# Altium schematic sheet TAFLab Sensors.SchDoc
size 297 x 209 mm
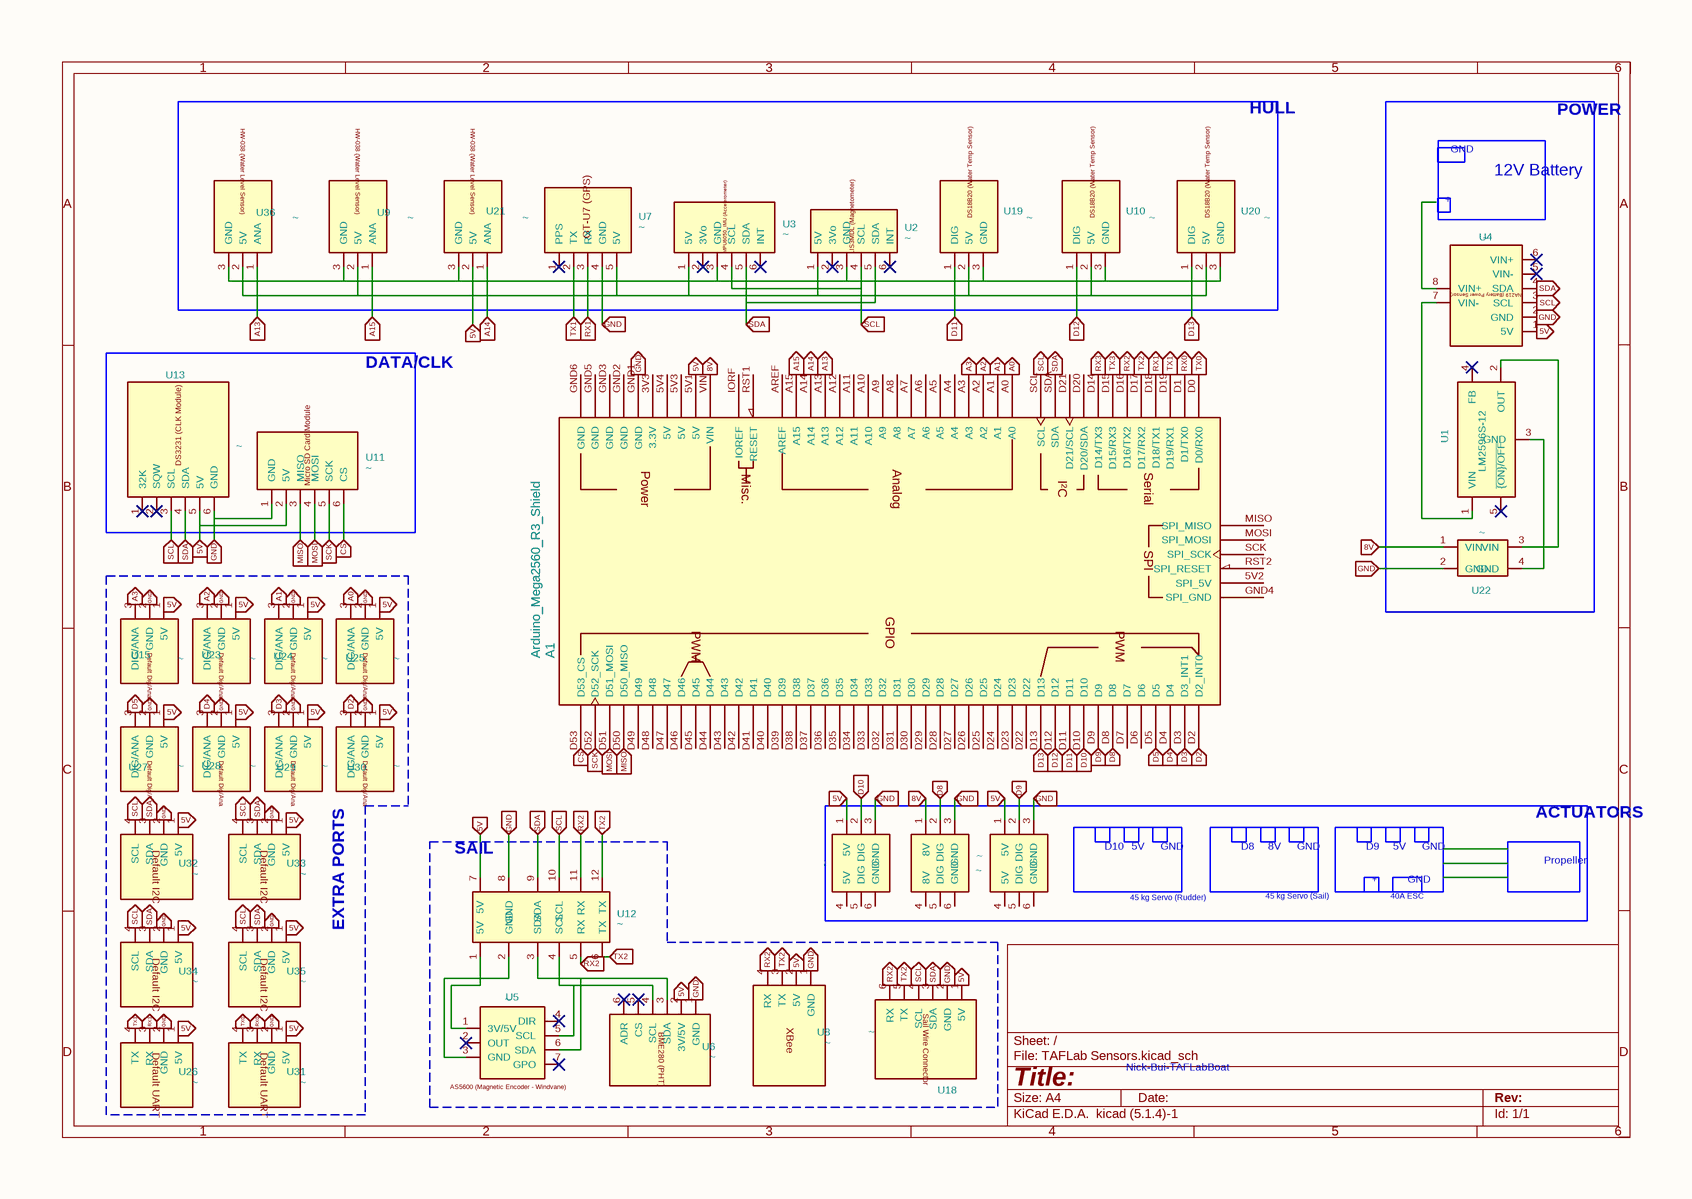
[diagram p0: TAFLab Sensors.SchDoc]

## Parts
A1  Arduino_Mega2560_R3_Shield  [Arduino_Mega2560_R3_Shield]
U1  LM2596S-12  [LM2596]
U2  ~  [LIS3MDL_Magnetometer]
U3  ~  [MPU6050_IMU_Accelerometer]
U4  ~  [INA219_BatteryPowerSensor]
U5  ~  [AS5600_Magnetic_Encoder_Windvane]
U6  ~  [BME280_PHT]
U7  ~  [GT-U7_GPS]
U8  ~  [XBeeBreakout]
U9  ~  [HW038_WaterLevelSensor]
U10  ~  [DS18B20_Water_Temp_Sensor]
U11  ~  [Micro_SD_Module]
U12  ~  [Top_Boat_PCB]
U13  ~  [HW84_DS3231_CLK_Module]
U14  ~  [ActuatorConnector]
U15  ~  [Default3Pin]
U16  ~  [ActuatorConnector]
U17  ~  [ActuatorConnector]
U18  ~  [SailWireConnector]
U19  ~  [DS18B20_Water_Temp_Sensor]
U20  ~  [DS18B20_Water_Temp_Sensor]
U21  ~  [HW038_WaterLevelSensor]
U22  ~  [VinArduinoConnector]
U23  ~  [Default3Pin]
U24  ~  [Default3Pin]
U25  ~  [Default3Pin]
U26  ~  [Default4Pin]
U27  ~  [Default3Pin]
U28  ~  [Default3Pin]
U29  ~  [Default3Pin]
U30  ~  [Default3Pin]
U31  ~  [Default4Pin]
U32  ~  [Default4Pin]
U33  ~  [Default4Pin]
U34  ~  [Default4Pin]
U35  ~  [Default4Pin]
U36  ~  [HW038_WaterLevelSensor]

## Blocks framed on the sheet
HULL: U2 U3 U7 U9 U10 U19-U21 U36
DATA/CLK: U11 U13
EXTRA PORTS: U15 U23-U35
ACTUATORS: U14 U16 U17
SAIL: U5 U6 U8 U12 U18

## Ports
5V (in), 8V (in), A0 (in), A1 (in), A2 (in), A3 (in), A13 (in), A14 (in), A15 (in), CS (in), D2 (in), D3 (in), D4 (in), D5 (in), D8 (in), D9 (in), D10 (in), D11 (in), D12 (in), D13 (in), GND (in), MISO (in), MOSI (in), RX0 (in), RX1 (in), RX2 (in), RX3 (in), SCK (in), SCL (in), SDA (in), TX0 (in), TX1 (in), TX2 (in), TX3 (in)

## Nets
5V: A1.5V1(5V) U2.1(5V) U3.1(5V) U4.1(5V) U6.2(3V/5V) U7.5(5V) U8.2(5V) U9.2(5V) U10.2(5V) U11.2(5V) U12.7(5V) U13.5(5V) U14.1(5V) U15.1(5V) U17.1(5V) U18.1(5V) U19.2(5V) U20.2(5V) U21.2(5V) U23.1(5V) U24.1(5V) U25.1(5V) U26.1(5V) U27.1(5V) U28.1(5V) U29.1(5V) U30.1(5V) U31.1(5V) U32.1(5V) U33.1(5V) U34.1(5V) U35.1(5V) U36.2(5V) ; port 5V
8V: A1.VIN U16.1(8V) U22.1(VIN) ; port 8V
A0: A1.A0 U25.3(DIG/ANA) ; port A0
A1: A1.A1 U24.3(DIG/ANA) ; port A1
A2: A1.A2 U23.3(DIG/ANA) ; port A2
A3: A1.A3 U15.3(DIG/ANA) ; port A3
A13: A1.A13 U36.1(ANA) ; port A13
A14: A1.A14 U21.1(ANA) ; port A14
A15: A1.A15 U9.1(ANA) ; port A15
CS: A1.D53(D53_CS) U11.6(CS) ; port CS
D2: A1.D2(D2_INT0) U30.3(DIG/ANA) ; port D2
D3: A1.D3(D3_INT1) U29.3(DIG/ANA) ; port D3
D4: A1.D4 U28.3(DIG/ANA) ; port D4
D5: A1.D5 U27.3(DIG/ANA) ; port D5
D8: A1.D8 U16.2(DIG) ; port D8
D9: A1.D9 U17.2(DIG) ; port D9
D10: A1.D10 U14.2(DIG) ; port D10
D11: A1.D11 U19.1(DIG) ; port D11
D12: A1.D12 U10.1(DIG) ; port D12
D13: A1.D13 U20.1(DIG) ; port D13
GND: A1.GND1(GND) U2.3(GND) U3.3(GND) U4.2(GND) U6.1(GND) U7.4(GND) U8.1(GND) U9.3(GND) U10.3(GND) U11.1(GND) U12.8(GND) U13.6(GND) U14.3(GND) U15.2(GND) U16.3(GND) U17.3(GND) U18.2(GND) U19.3(GND) U20.3(GND) U21.3(GND) U22.2(GND) U23.2(GND) U24.2(GND) U25.2(GND) U26.2(GND) U27.2(GND) U28.2(GND) U29.2(GND) U30.2(GND) U31.2(GND) U32.2(GND) U33.2(GND) U34.2(GND) U35.2(GND) U36.3(GND) ; port GND
MISO: A1.D50(D50_MISO) U11.3(MISO) ; port MISO
MOSI: A1.D51(D51_MOSI) U11.4(MOSI) ; port MOSI
RX0: A1.D1(D1/TX0) U31.3(RX) ; port RX0
RX1: A1.D18(D18/TX1) U7.3(RX) ; port RX1
RX2: A1.D16(D16/TX2) U8.4(RX) U12.5(RX) U12.11(RX) U18.6(RX) ; port RX2
RX3: A1.D14(D14/TX3) U26.3(RX) ; port RX3
SCK: A1.D52(D52_SCK) U11.5(SCK) ; port SCK
SCL: A1.SCL U2.4(SCL) U3.4(SCL) U4.3(SCL) U12.10(SCL) U13.3(SCL) U18.4(SCL) U32.4(SCL) U33.4(SCL) U34.4(SCL) U35.4(SCL) ; port SCL
SDA: A1.SDA U2.5(SDA) U3.5(SDA) U4.4(SDA) U12.9(SDA) U13.4(SDA) U18.3(SDA) U32.3(SDA) U33.3(SDA) U34.3(SDA) U35.3(SDA) ; port SDA
TX0: A1.D0(D0/RX0) U31.4(TX) ; port TX0
TX1: A1.D19(D19/RX1) U7.2(TX) ; port TX1
TX2: A1.D17(D17/RX2) U8.3(TX) U12.6(TX) U12.12(TX) U18.5(TX) ; port TX2
TX3: A1.D15(D15/RX3) U26.4(TX) ; port TX3
NetU1_1: U1.1(VIN) U4.7(VIN-)
NetU1_2: U1.2(OUT) U22.3(VIN)
NetU1_3: U1.3(GND) U22.4(GND)
NetU5_1: U5.1(3V/5V) U12.1(5V)
NetU5_3: U5.3(GND) U12.2(GND)
NetU5_5: U5.5(SCL) U6.4(SCL) U12.4(SCL)
NetU5_6: U5.6(SDA) U6.3(SDA) U12.3(SDA)

Not connected (* = marked no-connect by the designer): A1 3V3(3.3V) 5V2(SPI_5V) 5V3(5V) 5V4(5V) A4 A5 A6 A7 A8 A9 A10 A11 A12 AREF D6 D7 D20(D20/SDA) D21(D21/SCL) D22 D23 D24 D25 D26 D27 D28 D29 D30 D31 D32 D33 D34 D35 D36 D37 D38 D39 D40 D41 D42 D43 D44 D45 D46 D47 D48 D49 GND2(GND) GND3(GND) GND4(SPI_GND) GND5(GND) GND6(GND) IORF(IOREF) MISO(SPI_MISO) MOSI(SPI_MOSI) RST1(RESET) RST2(SPI_RESET) SCK(SPI_SCK); U1 4(FB)* 5(~{{ON}/OFF})*; U2 2(3Vo)* 6(INT)*; U3 2(3Vo)* 6(INT)*; U4 5(VIN-)* 6(VIN+)* 8(VIN+); U5 2(OUT)* 4(DIR)* 7(GPO)*; U6 5(CS)* 6(ADR)*; U7 1(PPS)*; U13 1(32K)* 2(SQW)*; U14 4(5V) 5(DIG) 6(GND); U16 4(8V) 5(DIG) 6(GND); U17 4(5V) 5(DIG) 6(GND)

## Notes on the sheet
- POWER
- (near U4) +
- GND
- 12V Battery
- D10
- 5V
- D8
- 8V
- D9
- Propeller
- 45 kg Servo (Rudder)
- 45 kg Servo (Sail)
- +
- 40A ESC
- Nick-Bui-TAFLabBoat
- 1
- 2
- 3
- 4
- 5
- 6
- A
- B
- C
- D
- Title:
- File: TAFLab Sensors.kicad_sch
- Sheet: /
- KiCad E.D.A.  kicad (5.1.4)-1
- Size: A4
- Date:
- Rev:
- Id: 1/1
- (in symbol Arduino_Mega2560_R3_Shield) Power; Misc.; Analog; I²C; Serial; SPI; GPIO; PWM
- (in symbol AS5600_Magnetic_Encoder_Windvane) AS5600 (Magnetic Encoder - Windvane)
- (in symbol BME280_PHT) BME280 (PHT)
- (in symbol Default_Dig/Ana) Default Dig/Ana
- (in symbol Default_I2C) Default I2C
- (in symbol Default_UART) Default UART
- (in symbol DS18B20_Water_Temp_Sensor) DS18B20 (Water Temp Sensor)
- (in symbol GT-U7_GPS) GT-U7 (GPS)
- (in symbol HW84_DS3231_CLK_Module) DS3231 (CLK Module)
- (in symbol HW-038_WaterLevelSensor) HW-038 (Water Level Sensor)
- (in symbol INA219_BatteryPowerSensor) INA219 (Battery Power Sensor)
- (in symbol LIS3MDL_Magnetometer) LIS3MDL (Magnetometer)
- (in symbol Micro_SD_Card_Module) Micro SD Card Module
- (in symbol MPU6050_IMU_Accelerometer) MPU6050_IMU (Accelerometer)
- (in symbol SailWireConnector) Sail Wire Connector
- (in symbol XBeeBreakout) XBee

## Library data of the parts
A1 = Arduino_Mega2560_R3_Shield: Description: Shield for Arduino Mega 2560 R3; Value: Arduino_Mega2560_R3_Shield; Footprint: PCM_arduino-library:Arduino_Mega2560_R3_Shield
U1 = LM2596S-12: Description: 12V 3A Step-Down Voltage Regulator, TO-263; Value: LM2596S-12; Footprint: TAFLab-Footprint-Library:LM2596
U2 = LIS3MDL_Magnetometer: Value: ~; Footprint: TAFLab-Footprint-Library:LIS3MDL_Magnetometer
U3 = MPU6050_IMU_Accelerometer: Value: ~; Footprint: TAFLab-Footprint-Library:MPU6050_IMU_Accelerometer
U4 = INA219_BatteryPowerSensor: Value: ~; Footprint: TAFLab-Footprint-Library:INA219_BatteryPowerSensor
U5 = AS5600_Magnetic_Encoder_Windvane: Value: ~; Footprint: TAFLab-Footprint-Library:AS5600_Magnetic_Encoder_Windvane
U6 = BME280_PHT: Value: ~; Footprint: TAFLab-Footprint-Library:BME280_PHT
U7 = GT-U7_GPS: Value: ~; Footprint: TAFLab-Footprint-Library:GT-U7_GPS
U8 = XBeeBreakout: Value: ~; Footprint: TAFLab-Footprint-Library:XBeeBreakout
U9 U21 U36 = HW-038_WaterLevelSensor: Value: ~; Footprint: TAFLab-Footprint-Library:HW038_WaterLevelSensor
U10 U19 U20 = DS18B20_Water_Temp_Sensor: Value: ~; Footprint: TAFLab-Footprint-Library:DS18B20_Water_Temp_Sensor
U11 = Micro_SD_Card_Module: Value: ~; Footprint: TAFLab-Footprint-Library:Micro_SD_Module
U12 = Top_Boat_Symbol: Value: ~; Footprint: TAFLab-Footprint-Library:Top_Boat_PCB
U13 = HW84_DS3231_CLK_Module: Value: ~; Footprint: TAFLab-Footprint-Library:HW84_DS3231_CLK_Module
U14 = RudderConnector: Value: ~; Footprint: TAFLab-Footprint-Library:ActuatorConnector
U15 U23-U25 U27-U30 = Default_Dig/Ana: Value: ~; Footprint: TAFLab-Footprint-Library:Default3Pin
U16 = SailConnector: Value: ~; Footprint: TAFLab-Footprint-Library:ActuatorConnector
U17 = ESCConnector: Value: ~; Footprint: TAFLab-Footprint-Library:ActuatorConnector
U18 = SailWireConnector: Value: ~; Footprint: TAFLab-Footprint-Library:SailWireConnector
U22 = VinConnector: Value: ~; Footprint: TAFLab-Footprint-Library:VinArduinoConnector
U26 U31 = Default_UART: Value: ~; Footprint: TAFLab-Footprint-Library:Default4Pin
U32-U35 = Default_I2C: Value: ~; Footprint: TAFLab-Footprint-Library:Default4Pin